# Altium schematic sheet M4QIDB-SCH-01 Sheet2.SchDoc: Microcontroller
size Letter; Author: JRL; Organization: Engenuics Technologies Inc; Address1: 88 Dalhurst Way NW; Address2: CALGARY AB; Address3: CANADA T3A 1N7; Address4: 1-888-912-3451; DocumentNumber: M4QIDB-SCH; Revision: 1; SheetNumber: 2; SheetTotal: 3
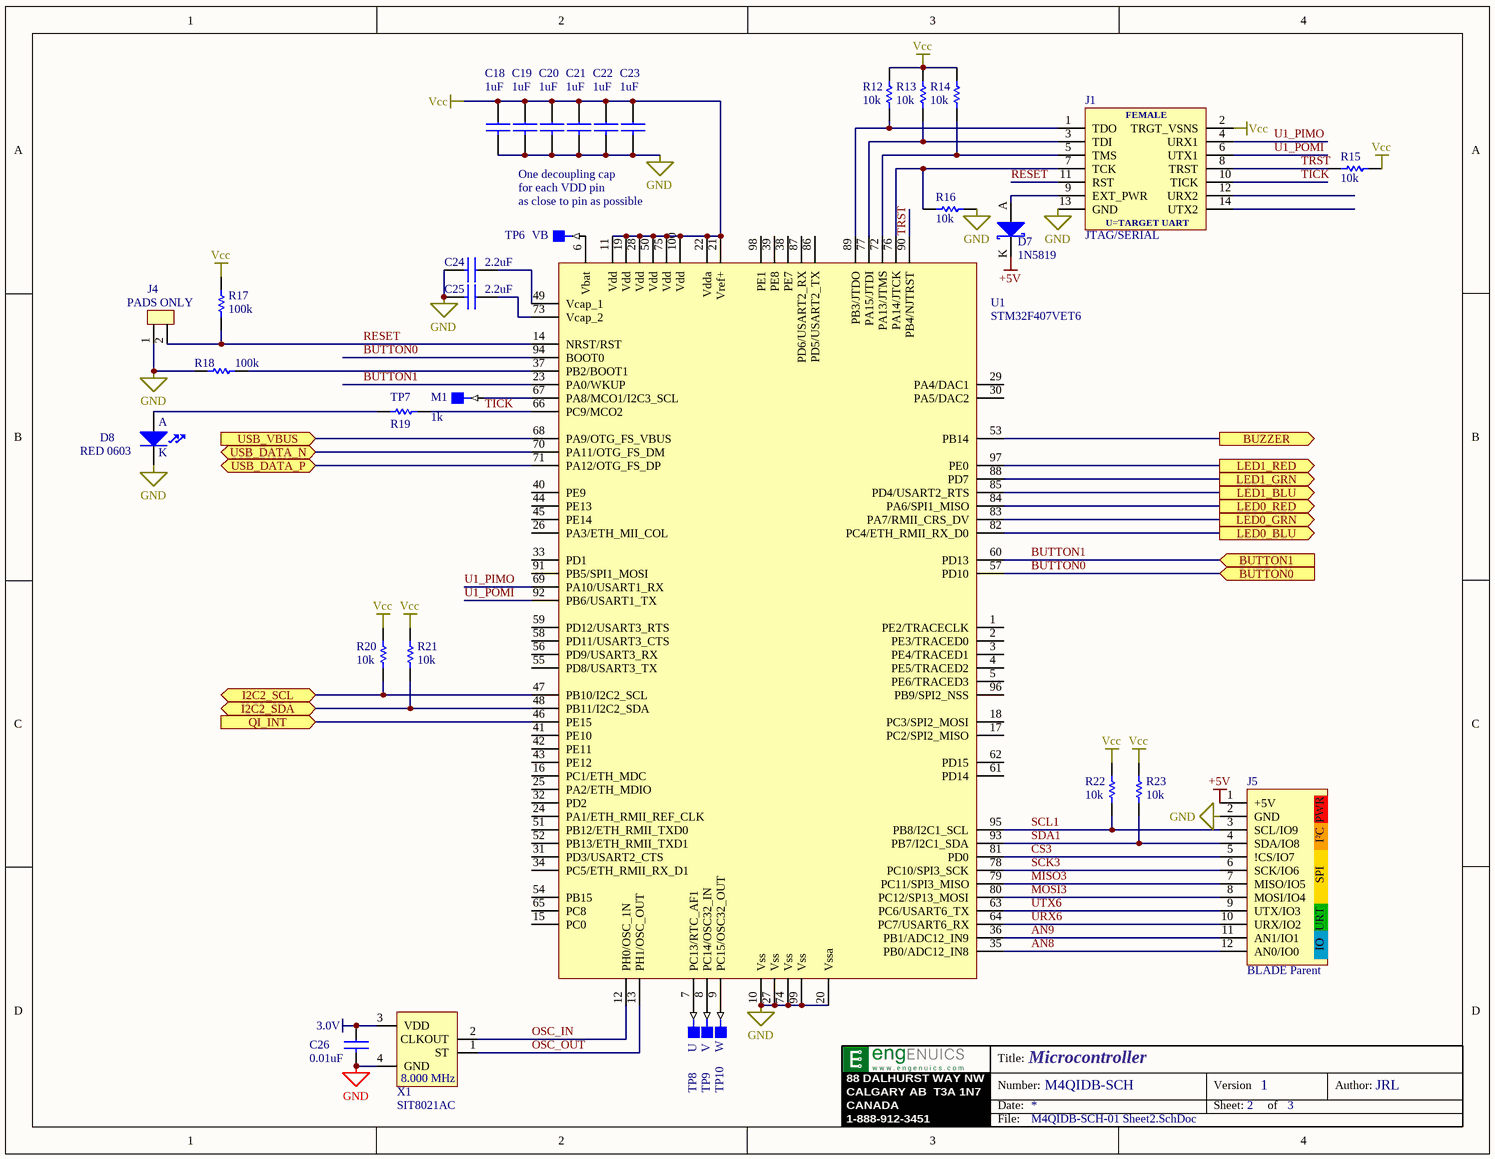
[diagram p0: M4QIDB-SCH-01 Sheet2.SchDoc]

## Parts
C18  1uF  [0603 CAP3D]
C19  1uF  [0603 CAP3D]
C20  1uF  [0603 CAP3D]
C21  1uF  [0603 CAP3D]
C22  1uF  [0603 CAP3D]
C23  1uF  [0603 CAP3D]
C24  2.2uF  [0603 CAP3D]
C25  2.2uF  [0603 CAP3D]
C26  0.01uF  [0603 CAP3D]
D7  1N5819  [SOD123 AK]
D8  RED 0603  [0603 AK]
J1  JTAG/SERIAL  [CONN 14POS 7X2 SMT FEMALE]
J4  PADS ONLY  [HDR1X2]  (no BOM)
J5  BLADE Parent  [HDR1X12 ENGENUICS PARENT]
R12  10k  [0603]
R13  10k  [0603]
R14  10k  [0603]
R15  10k  [0603]
R16  10k  [0603]
R17  100k  [0603]
R18  100k  [0603]
R19  1k  [0603]
R20  10k  [0603]
R21  10k  [0603]
R22  10k  [0603]
R23  10k  [0603]
TP6  VB  [TEST POINT SMT]  (no BOM)
TP7  M1  [TEST POINT SMT]  (no BOM)
TP8  U  [TEST POINT SMT]  (no BOM)
TP9  V  [TEST POINT SMT]  (no BOM)
TP10  W  [TEST POINT SMT]  (no BOM)
U1  STM32F407VET6  [LQFP100]
X1  SIT8021AC  [CSP 1.55mm x 0.85mm]

## Ports
BUTTON0 (in), BUTTON1 (in), BUZZER (out), I2C2_SCL (bidir), I2C2_SDA (bidir), LED0_BLU (out), LED0_GRN (out), LED0_RED (out), LED1_BLU (out), LED1_GRN (out), LED1_RED (out), QI_INT (in), USB_DATA_N (bidir), USB_DATA_P (bidir), USB_VBUS (in)

## Nets
3.0V: C26.1 X1.3(VDD)
+5V: D7.K J5.1(+5V)
GND: C18.2 C19.2 C20.2 C21.2 C22.2 C23.2 C24.2 C25.2 C26.2 D8.K J1.13(GND) J4.1 J5.2(GND) R16.1 R18.2 U1.10(Vss) U1.20(Vssa) U1.27(Vss) U1.74(Vss) U1.99(Vss) X1.4(GND)
Vcc: C18.1 C19.1 C20.1 C21.1 C22.1 C23.1 J1.2(TRGT_VSNS) R12.2 R13.2 R14.2 R15.1 R17.2 R20.2 R21.2 R22.2 R23.2 U1.11(Vdd) U1.19(Vdd) U1.21(Vref+) U1.22(Vdda) U1.28(Vdd) U1.50(Vdd) U1.75(Vdd) U1.100(Vdd)
AN8: J5.12(AN0/IO0) U1.35(PB0/ADC12_IN8)
AN9: J5.11(AN1/IO1) U1.36(PB1/ADC12_IN9)
BUTTON0: U1.57(PD10) U1.94(BOOT0) ; port BUTTON0
BUTTON1: U1.23(PA0/WKUP) U1.60(PD13) ; port BUTTON1
BUZZER: U1.53(PB14) ; port BUZZER
CS3: J5.5(!CS/IO7) U1.81(PD0)
I2C2_SCL: R20.1 U1.47(PB10/I2C2_SCL) ; port I2C2_SCL
I2C2_SDA: R21.1 U1.48(PB11/I2C2_SDA) ; port I2C2_SDA
LED0_BLU: U1.82(PC4/ETH_RMII_RX_D0) ; port LED0_BLU
LED0_GRN: U1.83(PA7/RMII_CRS_DV) ; port LED0_GRN
LED0_RED: U1.84(PA6/SPI1_MISO) ; port LED0_RED
LED1_BLU: U1.85(PD4/USART2_RTS) ; port LED1_BLU
LED1_GRN: U1.88(PD7) ; port LED1_GRN
LED1_RED: U1.97(PE0) ; port LED1_RED
MISO3: J5.7(MISO/IO5) U1.79(PC11/SPI3_MISO)
MOSI3: J5.8(MOSI/IO4) U1.80(PC12/SP13_MOSI)
OSC_IN: U1.12(PH0/OSC_1N) X1.2(CLKOUT)
OSC_OUT: U1.13(PH1/OSC_OUT) X1.1(ST)
QI_INT: U1.46(PE15) ; port QI_INT
RESET: J1.11(RST) J4.2 R17.1 U1.14(NRST/RST)
SCK3: J5.6(SCK/IO6) U1.78(PC10/SPI3_SCK)
SCL1: J5.3(SCL/IO9) R22.1 U1.95(PB8/I2C1_SCL)
SDA1: J5.4(SDA/IO8) R23.1 U1.93(PB7/I2C1_SDA)
TICK: J1.10(TICK) R19.2 U1.66(PC9/MCO2)
TRST: J1.8(TRST) R15.2 U1.90(PB4/NJTRST)
U1_PIMO: J1.4(URX1) U1.69(PA10/USART1_RX)
U1_POMI: J1.6(UTX1) U1.92(PB6/USART1_TX)
URX6: J5.10(URX/IO2) U1.64(PC7/USART6_RX)
USB_DATA_N: U1.70(PA11/OTG_FS_DM) ; port USB_DATA_N
USB_DATA_P: U1.71(PA12/OTG_FS_DP) ; port USB_DATA_P
USB_VBUS: U1.68(PA9/OTG_FS_VBUS) ; port USB_VBUS
UTX6: J5.9(UTX/IO3) U1.63(PC6/USART6_TX)
NetC24_1: C24.1 U1.49(Vcap_1)
NetC25_1: C25.1 U1.73(Vcap_2)
NetD7_A: D7.A J1.9(EXT_PWR)
NetD8_A: D8.A R19.1
NetJ1_1: J1.1(TDO) R12.1 U1.89(PB3/JTDO)
NetJ1_3: J1.3(TDI) R13.1 U1.77(PA15/JTDI)
NetJ1_5: J1.5(TMS) R14.1 U1.72(PA13/JTMS)
NetJ1_7: J1.7(TCK) R16.2 U1.76(PA14/JTCK)
NetR18_1: R18.1 U1.37(PB2/BOOT1)
NetTP6_1: TP6.1 U1.6(Vbat)
NetTP7_1: TP7.1 U1.67(PA8/MCO1/I2C3_SCL)
NetTP8_1: TP8.1 U1.7(PC13/RTC_AF1)
NetTP9_1: TP9.1 U1.8(PC14/OSC32_IN)
NetTP10_1: TP10.1 U1.9(PC15/OSC32_OUT)

Not connected (* = marked no-connect by the designer): J1 12(URX2) 14(UTX2); U1 1(PE2/TRACECLK) 2(PE3/TRACED0) 3(PE4/TRACED1) 4(PE5/TRACED2) 5(PE6/TRACED3) 15(PC0) 16(PC1/ETH_MDC) 17(PC2/SPI2_MISO) 18(PC3/SPI2_MOSI) 24(PA1/ETH_RMII_REF_CLK) 25(PA2/ETH_MDIO) 26(PA3/ETH_MII_COL) 29(PA4/DAC1) 30(PA5/DAC2) 31(PD3/USART2_CTS) 32(PD2) 33(PD1) 34(PC5/ETH_RMII_RX_D1) 38(PE7) 39(PE8) 40(PE9) 41(PE10) 42(PE11) 43(PE12) 44(PE13) 45(PE14) 51(PB12/ETH_RMII_TXD0) 52(PB13/ETH_RMII_TXD1) 54(PB15) 55(PD8/USART3_TX) 56(PD9/USART3_RX) 58(PD11/USART3_CTS) 59(PD12/USART3_RTS) 61(PD14) 62(PD15) 65(PC8) 86(PD5/USART2_TX) 87(PD6/USART2_RX) 91(PB5/SPI1_MOSI) 96(PB9/SPI2_NSS) 98(PE1)

## Notes on the sheet
- One decoupling cap
- for each VDD pin
- (near TP6) as close to pin as possible
- 88 DALHURST WAY NW
- CALGARY AB  T3A 1N7
- CANADA
- Title:
- Number:
- Date:
- Version
- Sheet:
- of
- Author:
- 1-888-912-3451
- File:
- (in symbol CONN ENGENUICS BLADE PARENT) PWR; I²C; SPI; URT; IO
- (in symbol CONN JTAG/SERIAL DEBUG 14POS FEMALE ENGENUICS) FEMALE; U=TARGET UART
- (in symbol IC OSCILLATOR SIT8021AC) 8.000 MHz

## Library data of the parts
C18-C23 = CAPACITOR NON-POLARIZED: 3. Manufacturer Part Number: EMK107BJ105KA-T; 2. Manufacturer: Taiyo; 5. Internal Part Number: 100009; 1. Description: CAP CER 1uF 10% X5R 16V 0603 SMT; 7. Modified By: JRL; 4. Digi-Key Part Number: 587-1251-2-ND; 6. Last Modified: 2016-08-04
C24 C25 = CAPACITOR NON-POLARIZED: 3. Manufacturer Part Number: 445-5157-1-ND; 2. Manufacturer: TDK Corporation; 1. Description: CAP CER 2.2uF 10% X5R 16V 0603 SMT; 7. Modified By: JRL; 4. Digi-Key Part Number: C1608X5R1C225K/0.80; 6. Last Modified: 2016-08-04
C26 = CAPACITOR NON-POLARIZED: 3. Manufacturer Part Number: CL05B103KO5NNNC; 2. Manufacturer: Samsung; 1. Description: CAP CER 10000PF 16V X7R 0402; 7. Modified By: JRL; 5. Internal Part Number: *; 4. Digi-Key Part Number: 1276-1051-2-ND; 6. Last Modified: 2018-12-14
D7 = DIODE SCHOTTKY AK: 2. Manufacturer: Diodes Inc.; 3. Manufacturer Part Number: 1N5819HW-7-F; 5. Internal Part Number: 100039; 1. Description: DIODE SCHOTTKY 1A 40V SOD123; 7. Modified By: JRL; 4. Digi-Key Part Number: 1N5819HW-FDITR-ND; 6. Last Modified: 2016-07-31
D8 = LED AK: 2. Manufacturer: Kingbright Corp; 3. Manufacturer Part Number: APT1608SRCPRV; 1. Description: LED RED CLEAR 0603 SMD; 7. Modified By: JRL; 4. Digi-Key Part Number: 754-1122-2-ND; 6. Last Modified: 2012-12-18
J1 = CONN JTAG/SERIAL DEBUG 14POS FEMALE ENGENUICS: 2. Manufacturer: Samtec; 3. Manufacturer Part Number: FLE-107-01-G-DV; 1. Description: CONN RCPT .05" 14POS DUAL SMD; 7. Modified By: JRL; 4. Digi-Key Part Number: SAM1226-07-ND; 6. Last Modified: 2011-06-10
J4 = CONN SIP 2: 2. Manufacturer: *; 3. Manufacturer Part Number: *; 1. Description: PADS; 4. Digi-Key Part Number: *
J5 = CONN ENGENUICS BLADE PARENT: 2. Manufacturer: Sullins; 3. Manufacturer Part Number: PPTC121LGBN-RC; 5. Internal Part Number: 100031; 1. Description: CONN TERMINAL 12POS 0.100" RIGHT ANGLE; 7. Modified By: JRL; 4. Digi-Key Part Number: S5448-ND; 6. Last Modified: 2011-04-17
R12-R16 R20-R23 = RESISTOR: 2. Manufacturer: Vishay; 3. Manufacturer Part Number: CRCW060310K0FKEA; 5. Internal Part Number: 100079; 1. Description: RES 10K OHM 1/10W 1% 0603 SMD; 7. Modified By: JRL; 4. Digi-Key Part Number: 541-10.0KHTR-ND; 6. Last Modified: 2016-07-31
R17 R18 = RESISTOR: 2. Manufacturer: Yageo; 3. Manufacturer Part Number: RC0603FR-07100KL; 5. Internal Part Number: 100078; 1. Description: RES 100K OHM 1/10W 1% 0603 SMD; 7. Modified By: JRL; 4. Digi-Key Part Number: 311-100KHRTR-ND; 6. Last Modified: 2016-08-04
R19 = RESISTOR: 2. Manufacturer: Vishay; 3. Manufacturer Part Number: CRCW06031K00FKEA; 1. Description: RES 1K 1/10W 1% 0603; 7. Modified By: KP; 4. Digi-Key Part Number: 541-1.00KHCT-ND; 6. Last Modified: 2012-12-17
TP6-TP10 = TEST POINT SMT: 1. Description: Test pad; 7. Modified By: JRL; 2. Manufacturer: N/A; 3. Manufacturer Part Number: N/A; 4. Digi-Key Part Number: N/A; 6. Last Modified: 2012-12-16
U1 = MCU STM32F407Vx M4QIDB: 2. Manufacturer: ST MICRO; 7. Modified By: JRL; 1. Description: MCU CORTEX-M3 STM32F407Vx LQFP100; 3. Manufacturer Part Number: STM32F407VET6; 4. Digi-Key Part Number: 497-12075-ND; 5. Internal Part Number: *; 6. Last Modified: 2016-06-27
X1 = IC OSCILLATOR SIT8021AC: 2. Manufacturer: SiTIME; 3. Manufacturer Part Number: SiT8021AC-J4-XXS-8.000000D; 1. Description: MEMS OSC XO 32.7680KHZ LVCMOS; 7. Modified By: JRL; 4. Digi-Key Part Number: N/A; 5. Internal Part Number: *; 6. Last Modified: 2018-11-20